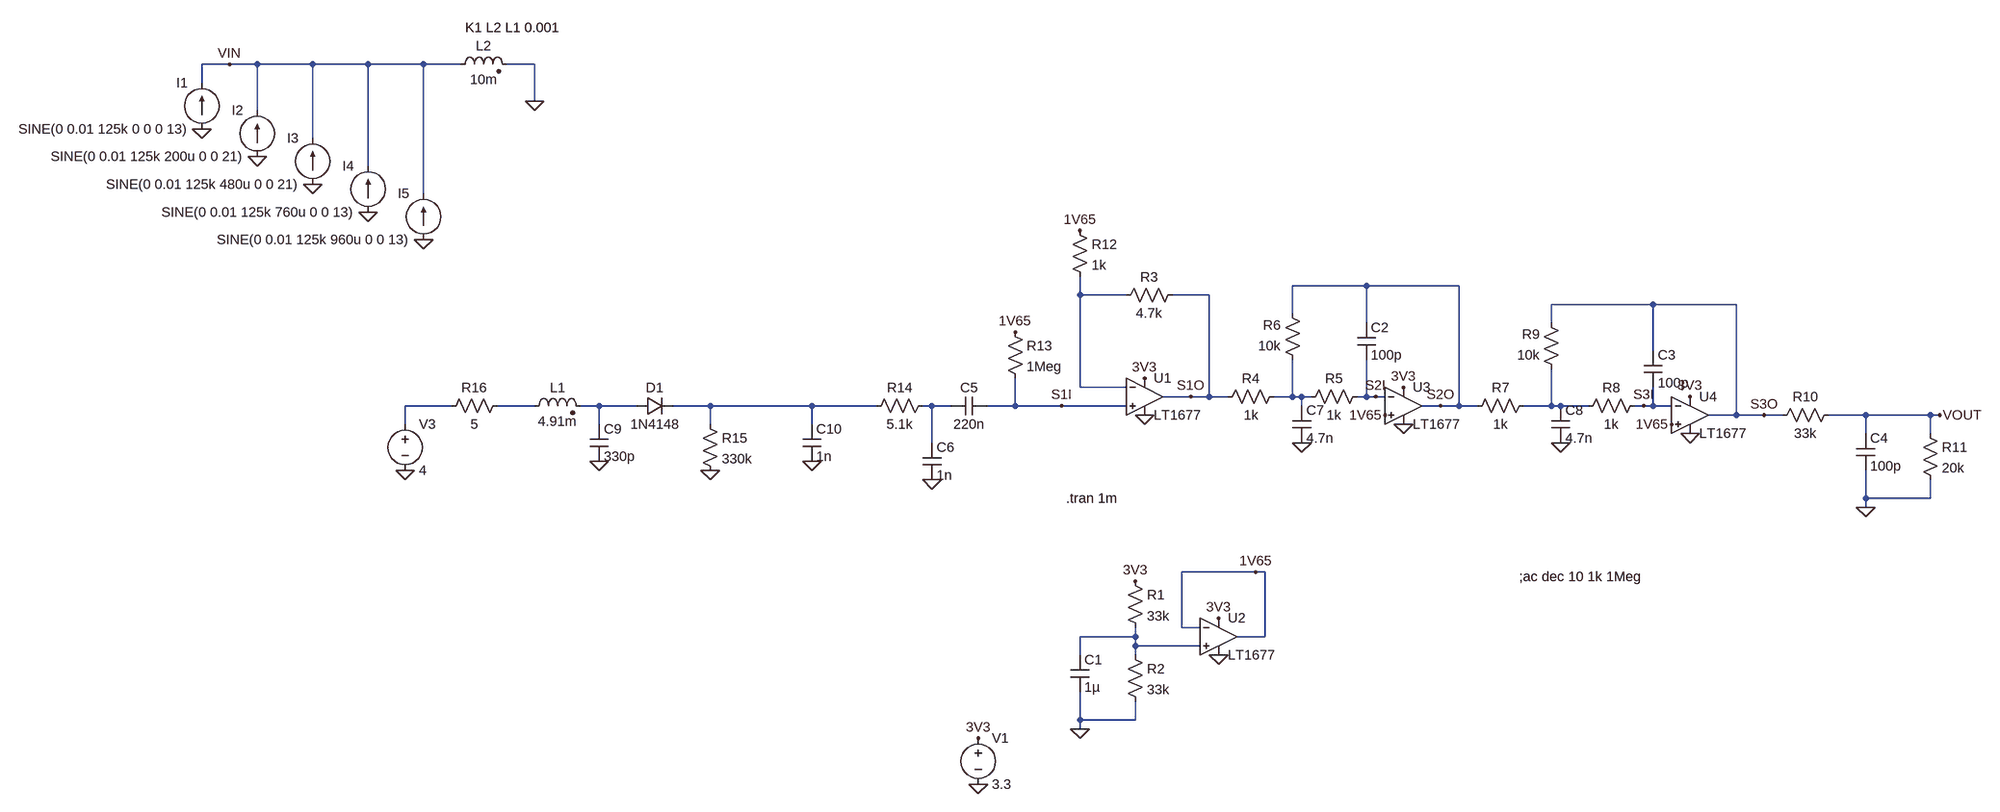
[diagram p0: schematic RFID.asc]
RFID.asc, the LTspice schematic file:
Version 4
SHEET 1 1520 680
WIRE -1520 -704 -1568 -704
WIRE -1472 -704 -1520 -704
WIRE -1376 -704 -1472 -704
WIRE -1280 -704 -1376 -704
WIRE -1184 -704 -1280 -704
WIRE -1120 -704 -1184 -704
WIRE -992 -704 -1040 -704
WIRE -1568 -672 -1568 -704
WIRE -992 -640 -992 -704
WIRE -1472 -624 -1472 -704
WIRE -1376 -576 -1376 -704
WIRE -1280 -528 -1280 -704
WIRE -1184 -480 -1184 -704
WIRE 448 -320 320 -320
WIRE 608 -320 448 -320
WIRE -48 -304 -48 -336
WIRE 32 -304 -48 -304
WIRE 176 -304 112 -304
WIRE 944 -288 768 -288
WIRE 1088 -288 944 -288
WIRE 320 -272 320 -320
WIRE 448 -256 448 -320
WIRE 768 -256 768 -288
WIRE 944 -208 944 -288
WIRE -48 -144 -48 -304
WIRE 32 -144 -48 -144
WIRE 144 -128 96 -128
WIRE 176 -128 176 -304
WIRE 176 -128 144 -128
WIRE 208 -128 176 -128
WIRE 320 -128 320 -192
WIRE 320 -128 288 -128
WIRE 336 -128 320 -128
WIRE 352 -128 336 -128
WIRE 448 -128 448 -192
WIRE 448 -128 432 -128
WIRE 464 -128 448 -128
WIRE 480 -128 464 -128
WIRE -1136 -112 -1216 -112
WIRE -992 -112 -1056 -112
WIRE -880 -112 -912 -112
WIRE -816 -112 -880 -112
WIRE -688 -112 -752 -112
WIRE -512 -112 -688 -112
WIRE -400 -112 -512 -112
WIRE -304 -112 -320 -112
WIRE -272 -112 -304 -112
WIRE -160 -112 -160 -160
WIRE -160 -112 -208 -112
WIRE -80 -112 -160 -112
WIRE 32 -112 -80 -112
WIRE 336 -112 336 -128
WIRE 576 -112 544 -112
WIRE 608 -112 608 -320
WIRE 608 -112 576 -112
WIRE 640 -112 608 -112
WIRE 768 -112 768 -176
WIRE 768 -112 720 -112
WIRE 784 -112 768 -112
WIRE 832 -112 784 -112
WIRE 928 -112 912 -112
WIRE 944 -112 944 -144
WIRE 944 -112 928 -112
WIRE 976 -112 944 -112
WIRE 1088 -96 1088 -288
WIRE 1088 -96 1040 -96
WIRE 1136 -96 1088 -96
WIRE 1168 -96 1136 -96
WIRE 1312 -96 1248 -96
WIRE 1424 -96 1312 -96
WIRE 1440 -96 1424 -96
WIRE -1216 -80 -1216 -112
WIRE -880 -80 -880 -112
WIRE -688 -80 -688 -112
WIRE -512 -80 -512 -112
WIRE 1312 -64 1312 -96
WIRE 1424 -64 1424 -96
WIRE -304 -48 -304 -112
WIRE 1312 48 1312 0
WIRE 1424 48 1424 16
WIRE 1424 48 1312 48
WIRE 1312 64 1312 48
WIRE 256 176 128 176
WIRE 272 176 256 176
WIRE 128 272 128 176
WIRE 160 272 128 272
WIRE 48 288 48 272
WIRE 48 288 -48 288
WIRE 272 288 272 176
WIRE 272 288 224 288
WIRE 48 304 48 288
WIRE 160 304 48 304
WIRE -48 320 -48 288
WIRE 48 320 48 304
WIRE -48 432 -48 384
WIRE 48 432 48 400
WIRE 48 432 -48 432
WIRE -48 448 -48 432
FLAG -224 544 0
FLAG -224 464 3V3
FLAG 64 -160 3V3
FLAG 64 -96 0
FLAG 192 256 3V3
FLAG 192 320 0
FLAG 256 176 1V65
FLAG -48 448 0
FLAG 48 192 3V3
FLAG 512 -144 3V3
FLAG 512 -80 0
FLAG 480 -96 1V65
FLAG 1008 -128 3V3
FLAG 1008 -64 0
FLAG 976 -80 1V65
FLAG 1440 -96 VOUT
FLAG 1312 64 0
FLAG -48 -416 1V65
FLAG -160 -240 1V65
FLAG -304 16 0
FLAG 336 -48 0
FLAG 784 -48 0
FLAG 144 -128 S1O
FLAG 464 -128 S2I
FLAG 576 -112 S2O
FLAG 928 -112 S3I
FLAG 1136 -96 S3O
FLAG -688 0 0
FLAG -880 -16 0
FLAG -1568 -592 0
FLAG -1520 -704 VIN
FLAG -80 -112 S1I
FLAG -992 -640 0
FLAG -1216 0 0
FLAG -512 -16 0
FLAG -1472 -544 0
FLAG -1376 -496 0
FLAG -1280 -448 0
FLAG -1184 -400 0
SYMBOL OpAmps\\LT1677 64 -192 R0
SYMATTR InstName U1
SYMBOL voltage -224 448 R0
WINDOW 123 0 0 Left 0
WINDOW 39 0 0 Left 0
SYMATTR InstName V1
SYMATTR Value 3.3
SYMBOL OpAmps\\LT1677 192 224 R0
SYMATTR InstName U2
SYMBOL res 32 176 R0
SYMATTR InstName R1
SYMATTR Value 33k
SYMBOL res 32 304 R0
SYMATTR InstName R2
SYMATTR Value 33k
SYMBOL cap -64 320 R0
SYMATTR InstName C1
SYMATTR Value 1µ
SYMBOL res 128 -320 R90
WINDOW 0 0 56 VBottom 2
WINDOW 3 32 56 VTop 2
SYMATTR InstName R3
SYMATTR Value 4.7k
SYMBOL res 304 -144 R90
WINDOW 0 0 56 VBottom 2
WINDOW 3 32 56 VTop 2
SYMATTR InstName R4
SYMATTR Value 1k
SYMBOL res 448 -144 R90
WINDOW 0 0 56 VBottom 2
WINDOW 3 32 56 VTop 2
SYMATTR InstName R5
SYMATTR Value 1k
SYMBOL res 336 -176 R180
WINDOW 0 36 76 Left 2
WINDOW 3 36 40 Left 2
SYMATTR InstName R6
SYMATTR Value 10k
SYMBOL OpAmps\\LT1677 512 -176 R0
SYMATTR InstName U3
SYMBOL cap 432 -256 R0
SYMATTR InstName C2
SYMATTR Value 100p
SYMBOL res 736 -128 R90
WINDOW 0 0 56 VBottom 2
WINDOW 3 32 56 VTop 2
SYMATTR InstName R7
SYMATTR Value 1k
SYMBOL res 928 -128 R90
WINDOW 0 0 56 VBottom 2
WINDOW 3 32 56 VTop 2
SYMATTR InstName R8
SYMATTR Value 1k
SYMBOL res 784 -160 R180
WINDOW 0 36 76 Left 2
WINDOW 3 36 40 Left 2
SYMATTR InstName R9
SYMATTR Value 10k
SYMBOL cap 928 -208 R0
SYMATTR InstName C3
SYMATTR Value 100p
SYMBOL OpAmps\\LT1677 1008 -160 R0
SYMATTR InstName U4
SYMBOL res 1264 -112 R90
WINDOW 0 0 56 VBottom 2
WINDOW 3 32 56 VTop 2
SYMATTR InstName R10
SYMATTR Value 33k
SYMBOL cap 1296 -64 R0
SYMATTR InstName C4
SYMATTR Value 100p
SYMBOL res 1408 -80 R0
SYMATTR InstName R11
SYMATTR Value 20k
SYMBOL res -64 -432 R0
SYMATTR InstName R12
SYMATTR Value 1k
SYMBOL cap -208 -128 R90
WINDOW 0 0 32 VBottom 2
WINDOW 3 32 32 VTop 2
SYMATTR InstName C5
SYMATTR Value 220n
SYMBOL res -176 -256 R0
SYMATTR InstName R13
SYMATTR Value 1Meg
SYMBOL res -304 -128 R90
WINDOW 0 0 56 VBottom 2
WINDOW 3 32 56 VTop 2
SYMATTR InstName R14
SYMATTR Value 5.1k
SYMBOL cap -320 -48 R0
SYMATTR InstName C6
SYMATTR Value 1n
SYMBOL cap 320 -112 R0
SYMATTR InstName C7
SYMATTR Value 4.7n
SYMBOL cap 768 -112 R0
SYMATTR InstName C8
SYMATTR Value 4.7n
SYMBOL ind2 -1008 -96 R270
WINDOW 0 32 56 VTop 2
WINDOW 3 5 56 VBottom 2
SYMATTR InstName L1
SYMATTR Value 4.91m
SYMATTR Type ind
SYMATTR SpiceLine Rser=40m
SYMBOL res -704 -96 R0
SYMATTR InstName R15
SYMATTR Value 330k
SYMBOL cap -896 -80 R0
SYMATTR InstName C9
SYMATTR Value 330p
SYMBOL diode -816 -96 R270
WINDOW 0 32 32 VTop 2
WINDOW 3 0 32 VBottom 2
SYMATTR InstName D1
SYMATTR Value 1N4148
SYMBOL ind2 -1136 -688 R270
WINDOW 0 32 56 VTop 2
WINDOW 3 5 56 VBottom 2
SYMATTR InstName L2
SYMATTR Value 10m
SYMATTR Type ind
SYMBOL res -1040 -128 R90
WINDOW 0 0 56 VBottom 2
WINDOW 3 32 56 VTop 2
SYMATTR InstName R16
SYMATTR Value 5
SYMBOL voltage -1216 -96 R0
WINDOW 123 0 0 Left 0
WINDOW 39 0 0 Left 0
SYMATTR InstName V3
SYMATTR Value 4
SYMBOL current -1568 -592 R180
WINDOW 0 24 80 Left 2
WINDOW 3 24 0 Left 2
WINDOW 123 0 0 Left 0
WINDOW 39 0 0 Left 0
SYMATTR InstName I1
SYMATTR Value SINE(0 0.01 125k 0 0 0 13)
SYMBOL cap -528 -80 R0
SYMATTR InstName C10
SYMATTR Value 1n
SYMBOL current -1472 -544 R180
WINDOW 0 24 80 Left 2
WINDOW 3 24 0 Left 2
WINDOW 123 0 0 Left 0
WINDOW 39 0 0 Left 0
SYMATTR InstName I2
SYMATTR Value SINE(0 0.01 125k 200u 0 0 21)
SYMBOL current -1376 -496 R180
WINDOW 0 24 80 Left 2
WINDOW 3 24 0 Left 2
WINDOW 123 0 0 Left 0
WINDOW 39 0 0 Left 0
SYMATTR InstName I3
SYMATTR Value SINE(0 0.01 125k 480u 0 0 21)
SYMBOL current -1280 -448 R180
WINDOW 0 24 80 Left 2
WINDOW 3 24 0 Left 2
WINDOW 123 0 0 Left 0
WINDOW 39 0 0 Left 0
SYMATTR InstName I4
SYMATTR Value SINE(0 0.01 125k 760u 0 0 13)
SYMBOL current -1184 -400 R180
WINDOW 0 24 80 Left 2
WINDOW 3 24 0 Left 2
WINDOW 123 0 0 Left 0
WINDOW 39 0 0 Left 0
SYMATTR InstName I5
SYMATTR Value SINE(0 0.01 125k 960u 0 0 13)
TEXT 712 184 Left 2 !;ac dec 10 1k 1Meg
TEXT -72 48 Left 2 !.tran 1m
TEXT -1112 -768 Left 2 !K1 L2 L1 0.001

The netlist it stands for:
* RFID.asc
XU1 S1I N001 3V3 0 S1O LT1677  ; pins In+ In- V+ V- OUT
V1 3V3 0 3.3
XU2 N009 1V65 3V3 0 1V65 LT1677  ; pins In+ In- V+ V- OUT
R1 3V3 N009 33k
R2 N009 0 33k
C1 N009 0 1µ
R3 S1O N001 4.7k
R4 N002 S1O 1k
R5 S2I N002 1k
R6 N002 S2O 10k
XU3 1V65 S2I 3V3 0 S2O LT1677  ; pins In+ In- V+ V- OUT
C2 S2O S2I 100p
R7 N008 S2O 1k
R8 S3I N008 1k
R9 N008 S3O 10k
C3 S3O S3I 100p
XU4 1V65 S3I 3V3 0 S3O LT1677  ; pins In+ In- V+ V- OUT
R10 VOUT S3O 33k
C4 VOUT 0 100p
R11 VOUT 0 20k
R12 1V65 N001 1k
C5 S1I N007 220n
R13 1V65 S1I 1Meg
R14 N007 N006 5.1k
C6 N007 0 1n
C7 N002 0 4.7n
C8 N008 0 4.7n
L1 N004 N005 4.91m Rser=40m
R15 N006 0 330k
C9 N005 0 330p
D1 N005 N006 1N4148
L2 VIN 0 10m
R16 N004 N003 5
V3 N003 0 4
I1 0 VIN SINE(0 0.01 125k 0 0 0 13)
C10 N006 0 1n
I2 0 VIN SINE(0 0.01 125k 200u 0 0 21)
I3 0 VIN SINE(0 0.01 125k 480u 0 0 21)
I4 0 VIN SINE(0 0.01 125k 760u 0 0 13)
I5 0 VIN SINE(0 0.01 125k 960u 0 0 13)
.model D D
.lib standard.dio
;ac dec 10 1k 1Meg
.tran 1m
K1 L2 L1 0.001
.lib LTC.lib
.backanno
.end